# EasyEDA Pro project hx_esp32c5_cam.eprj

# Schematic Schematic1
Board Name: Board1; Create Date: 2025-12-30; Page Name: P1; Project Name: hx_esp32c5_cam; Schematic Name: Schematic1; Update Date: 2026-01-05; Company: EasyEDA.com; Page Size: A4; Version: V1.0
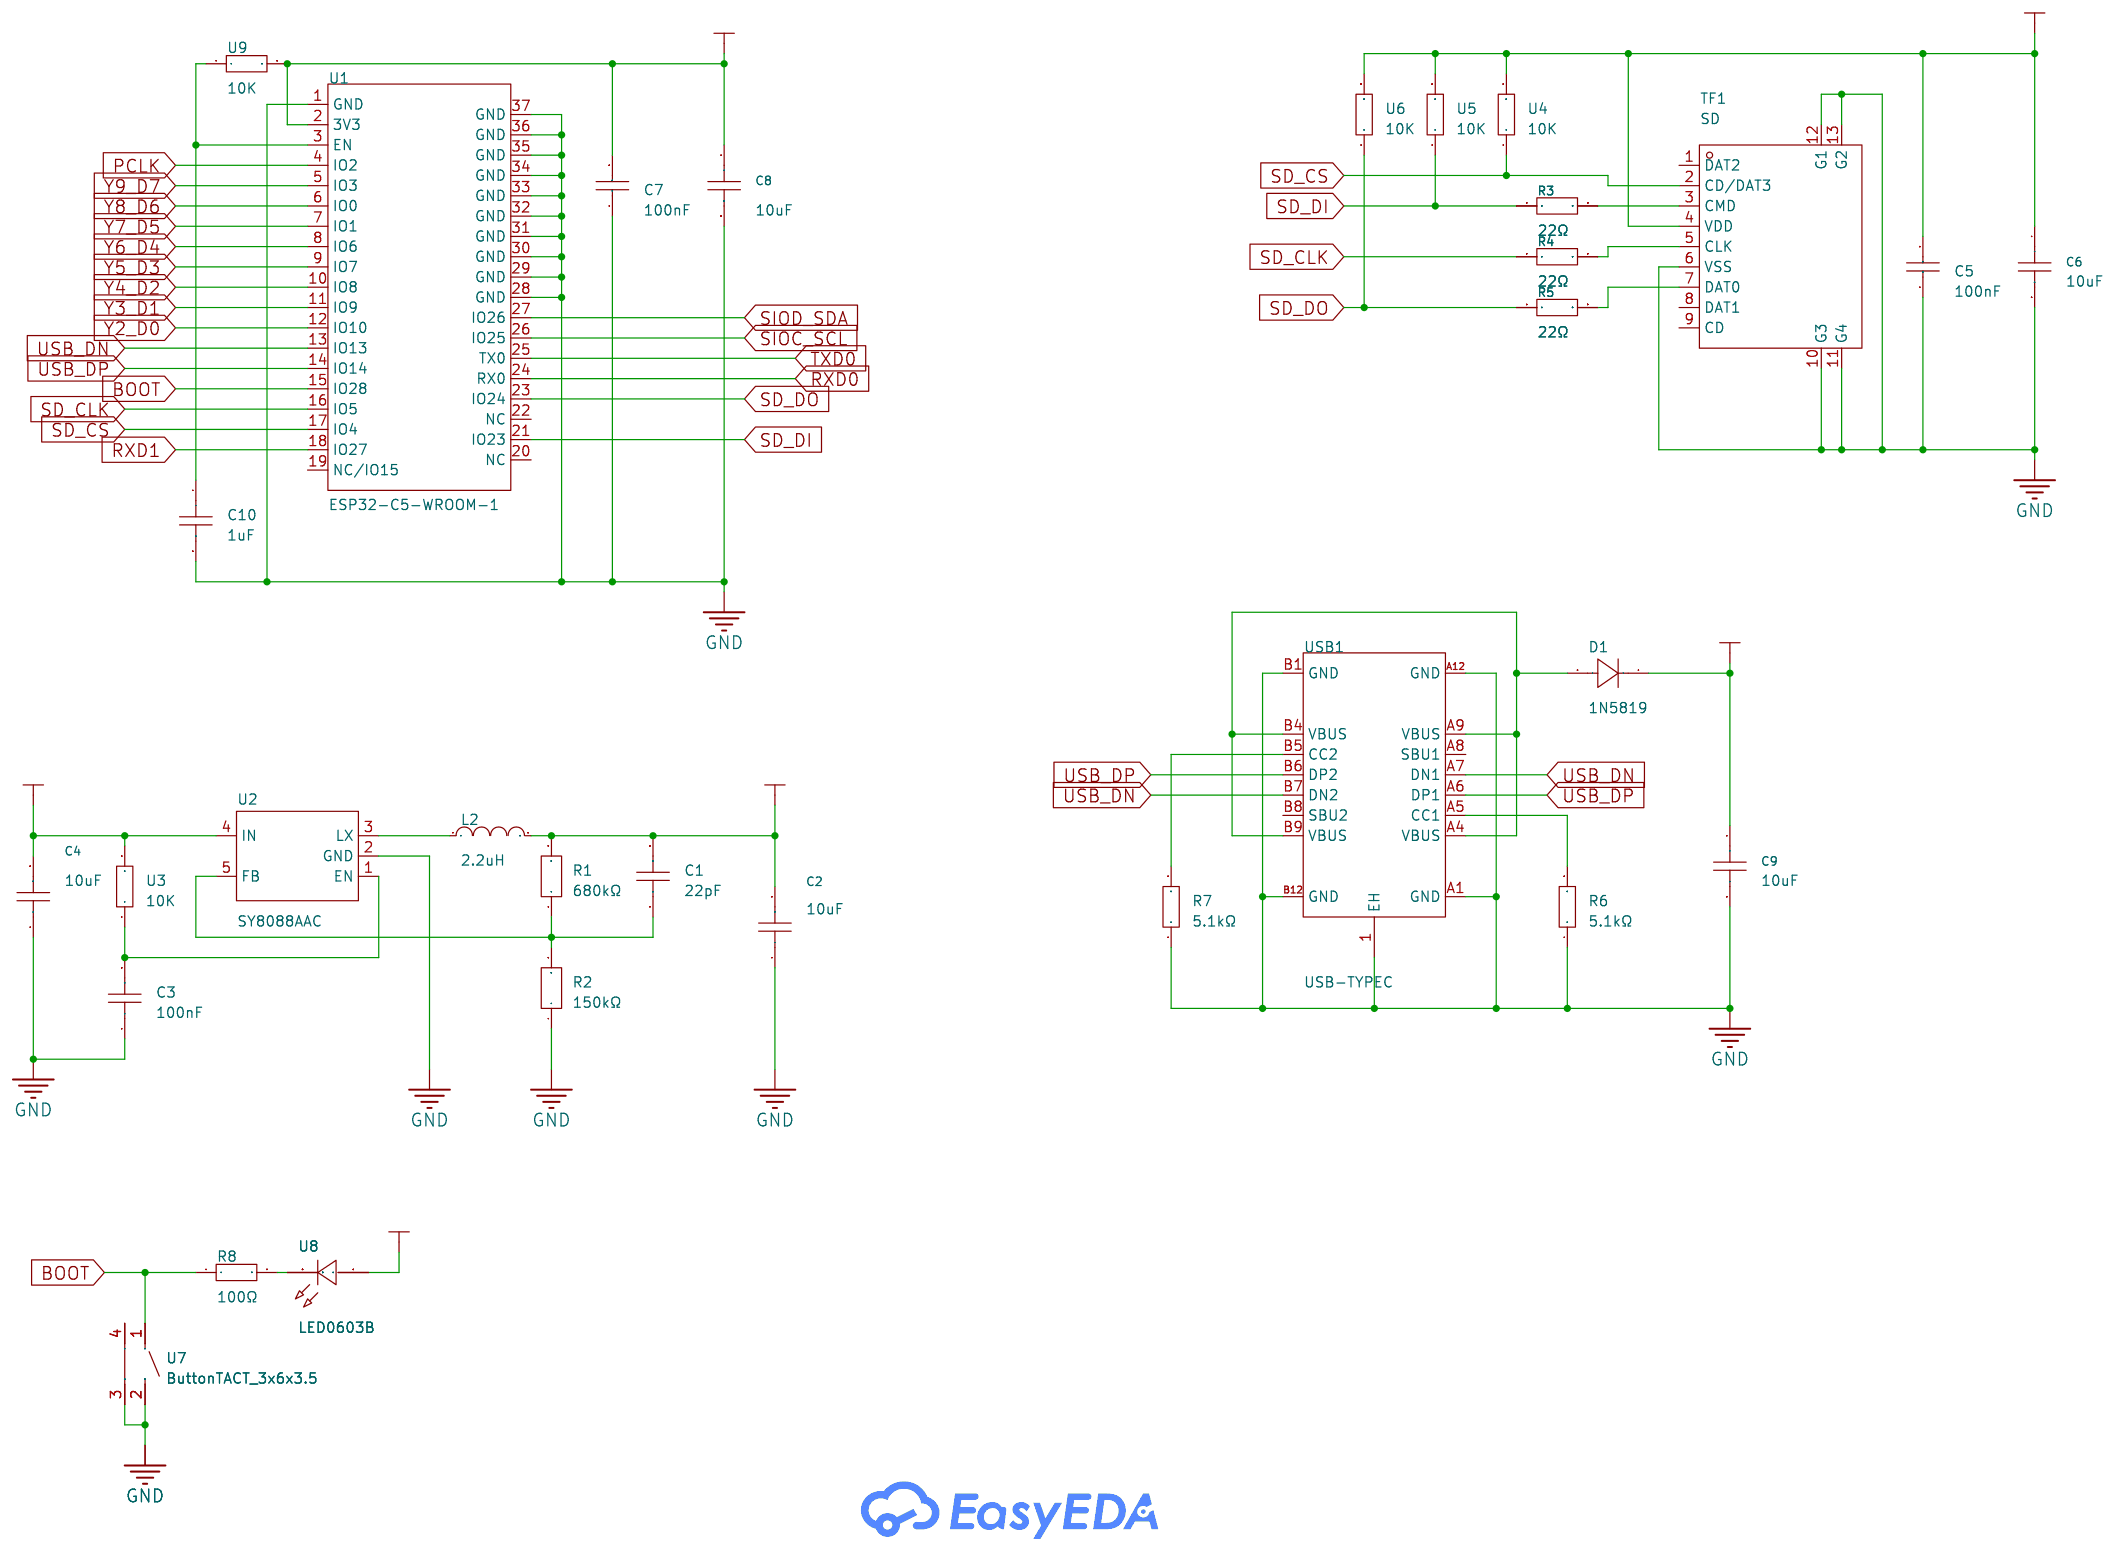
[diagram p0: schematic sheet]

## Parts
C1  22pF  [C0603]
C2  10uF  [C0603]
C3  100nF  [C0805]
C4  10uF  [C0603]
C5  100nF  [C0805]
C6  10uF  [C0603]
C7  100nF  [C0805]
C8  10uF  [C0603]
C9  10uF  [C0603]
C10  1uF  [C0603]
D1  1N5819  [SMA_L4.3-W2.7-LS5.1-RD]
L2  2.2uH  [IND-SMD_L2.0-W1.6_MHP201610]
R1  680kΩ  [R0805]
R2  150kΩ  [R0805]
R3  22Ω  [R0805]
R4  22Ω  [R0805]
R5  22Ω  [R0805]
R6  5.1kΩ  [R0805]
R7  5.1kΩ  [R0805]
R8  100Ω  [R0805]
TF1  SD  [TF-SMD_TF-15-15]
U1  ESP32-C5-WROOM-1  [COMM-SMD_37P-P1.27-L27.5-W18.0-ESP32-C5-WROOM-1]
U2  SY8088AAC  [SOT-23-5_L3.0-W1.7-P0.95-LS2.8-BR]
U3  10K  [R0805]
U4  10K  [R0805]
U5  10K  [R0805]
U6  10K  [R0805]
U7  ButtonTACT_3x6x3.5  [SW-SMD_L7.8-W3.5-P4.00-EH]
U8  LED0603B  [LED0603-R-RD_BLUE]
U9  10K  [R0805]
USB1  USB-TYPEC  [TYPE-C-SMD_16P-EH4]

## Library data of the parts
C1 = CC0603FPNPO9BN220: LCSC Part Name: 22pF ±1% 50V; Supplier Part: C1853871; Manufacturer: YAGEO(国巨); Supplier Footprint: 0603; JLCPCB Part Class: Extended Part; Datasheet: https://atta.szlcsc.com/upload/public/pdf/source/20210519/C1853871_98377D90EE8CBCBFC774064AEE2ACD16.pdf; Supplier: LCSC; Tolerance: ±1%; Voltage Rating: 50V; Temperature Coefficient: NP0
C2 C4 C6 C8 C9 = 10uF_C15415: LCSC Part Name: 10uF ±20% 16V; Supplier Part: C15415; Manufacturer: SAMSUNG(三星); Supplier Footprint: 0603; JLCPCB Part Class: Extended Part; Datasheet: https://atta.szlcsc.com/upload/public/pdf/source/20160218/1457707763339.pdf; Supplier: LCSC; Tolerance: ±20%
C3 = CC0805KRX7R9BB104: LCSC Part Name: 100nF ±10% 50V; Supplier Part: C49678; Manufacturer: YAGEO(国巨); Supplier Footprint: 0805; JLCPCB Part Class: Basic Part; Datasheet: https://item.szlcsc.com/datasheet/CC0805KRX7R9BB104/50686.html; Supplier: LCSC; Tolerance: ±10%; Voltage Rating: 50V; Temperature Coefficient: X7R
C5 C7 = CL21B104KCFNNNE: LCSC Part Name: 100nF ±10% 100V; Supplier Part: C28233; Manufacturer: SAMSUNG(三星); Supplier Footprint: 0805; JLCPCB Part Class: Basic Part; Datasheet: https://item.szlcsc.com/datasheet/CL21B104KCFNNNE/28983.html; Supplier: LCSC; Tolerance: ±10%; Voltage Rating: 100V; Temperature Coefficient: X7R
C10 = CGB3B1X6S1C105K055AC: LCSC Part Name: 1uF ±10% 16V; Supplier Part: C2169245; Manufacturer: TDK; Supplier Footprint: 0603; JLCPCB Part Class: Extended Part; Datasheet: https://atta.szlcsc.com/upload/public/pdf/source/20191105/C343012_3F47E91403558E3EBEE82CA44A798D40.pdf; Supplier: LCSC; Tolerance: ±10%
D1 = 1N5819: Supplier Part: C2892330; Supplier Footprint: SMA_L4.3-W2.7-LS5.1; JLCPCB Part Class: Extended Part; Supplier: LCSC
L2 = HPI201612P-2R2M: LCSC Part Name: 2.2uH ±20%; Supplier Part: C326048; Manufacturer: 3L COILS(三礼); Supplier Footprint: 0806; JLCPCB Part Class: Extended Part; Datasheet: https://atta.szlcsc.com/upload/public/pdf/source/20190129/C326177_DB7B9D3ABD54B912F06BF7766A7A8FBD.pdf; Supplier: LCSC; Tolerance: ±20%; Current Rating: 1.6A; DC Resistance(DCR): 120mΩ
R1 = TC0525B6803T5E: LCSC Part Name: 680kΩ ±0.1% 250mW 薄膜电阻; Supplier Part: C425382; Manufacturer: UNI-ROYAL(厚声); Supplier Footprint: 0805; JLCPCB Part Class: Extended Part; Datasheet: https://atta.szlcsc.com/upload/public/pdf/source/20190904/C425668_F2F639A313B6F33D501F342892FD5229.pdf; Supplier: LCSC; Type: Thin Film Resistor; Tolerance: ±0.1%; Temperature Coefficient: ±25ppm/℃; Operating Temperature Range: -55℃~+155℃
R2 = AS05W2J0154T5E: LCSC Part Name: 150kΩ ±5% 500mW 厚膜电阻 抗浪涌厚膜晶片电阻器; Supplier Part: C966139; Manufacturer: UNI-ROYAL(厚声); Supplier Footprint: 0805; JLCPCB Part Class: Extended Part; Datasheet: https://atta.szlcsc.com/upload/public/pdf/source/20200723/C560412_34ABBCC623B52ADD707B94178459E29E.pdf; Supplier: LCSC; Type: Thick Film Resistors; Tolerance: ±5%; Temperature Coefficient: ±100ppm/℃; Operating Temperature: -55℃~+155℃
R3-R5 = RMC0805225%N: LCSC Part Name: 22Ω ±5% 125mW; Supplier Part: C269553; Manufacturer: Tyohm(幸亚电阻); Supplier Footprint: 0805; JLCPCB Part Class: Extended Part; Datasheet: https://item.szlcsc.com/datasheet/RMC0805225%2525N/258993.html; Supplier: LCSC; Type: Thick Film Resistor; Tolerance: ±5%; Power(Watts): 125mW; Voltage-Supply(Max): 150V; Temperature Coefficient: ±100ppm/℃; Operating Temperature: -55℃~+155℃
R6 R7 = AECR0805F5K10K9: LCSC Part Name: 车规级 厚膜电阻 5.1kΩ ±1% 125mW; Supplier Part: C328405; Manufacturer: RESI(开步睿思); Supplier Footprint: 0805; JLCPCB Part Class: Extended Part; Datasheet: https://item.szlcsc.com/datasheet/AECR0805F5K10K9/308307.html; Supplier: LCSC; Type: Thick Film Resistor; Tolerance: ±1%; Power(Watts): 125mW; Voltage-Supply(Max): 150V; Temperature Coefficient: ±100ppm/℃; Operating Temperature: -55℃~+155℃
R8 = MCR10EZHJ101: LCSC Part Name: 100Ω ±5% 125mW; Supplier Part: C308365; Manufacturer: ROHM(罗姆); Supplier Footprint: 0805; JLCPCB Part Class: Extended Part; Datasheet: https://atta.szlcsc.com/upload/public/pdf/source/20180927/C308562_C105FB47EB7519E2A4C533708F7CD71F.pdf; Supplier: LCSC; Tolerance: ±5%; Temperature Coefficient: ±200ppm/℃
TF1 = SD: Supplier Part: C9900023771; Supplier Footprint: SIM-SMD; JLCPCB Part Class: Extended Part; Supplier: LCSC
U1 = ESP32-C5-WROOM-1: Supplier Part: C9900205328; Supplier: LCSC
U2 = SY8088AAC: LCSC Part Name: 1.5MHz 1A 同步降压DC/DC调节器; Supplier Part: C79313; Manufacturer: silergy(矽力杰); Supplier Footprint: SOT-23-5; JLCPCB Part Class: Extended Part; Datasheet: https://atta.szlcsc.com/upload/public/pdf/source/20170329/1490752163260.pdf; Supplier: LCSC; Function: Step-down type; Voltage - Supply: 2.5V~5.5V; Frequency - Switching: 1.5MHz; Operating Temperature: -40℃~+125℃; Synchronous Rectifier: Yes; Number of Outputs: 1; Topology: Step-down; Quiescent Current: 40uA
U3-U6 U9 = 10K: Supplier Part: C9900011271; JLCPCB Part Class: Extended Part; Supplier: LCSC
U7 = ButtonTACT_3x6x3.5: Supplier Part: C9900004514; Supplier Footprint: SMD; JLCPCB Part Class: Extended Part; Supplier: LCSC
U8 = LED0603B_C9900038277: Supplier Part: C9900038277; Supplier Footprint: LED0603-BLUE; JLCPCB Part Class: Extended Part; Supplier: LCSC
USB1 = USB-TYPEC: Supplier Part: C9900005249; JLCPCB Part Class: Extended Part; Supplier: LCSC

## Nets
GND: C2.1 C3.1 C4.1 C5.1 C6.2 C7.1 C8.2 C9.2 C10.2 R2.1 R6.1 R7.1 TF1.6(VSS) TF1.10(G3) TF1.11(G4) TF1.12(G1) TF1.13(G2) U1.1(GND) U1.28(GND) U1.29(GND) U1.30(GND) U1.31(GND) U1.32(GND) U1.33(GND) U1.34(GND) U1.35(GND) U1.36(GND) U1.37(GND) U2.2(GND) U7.2 U7.3 USB1.1(EH) USB1.A1(GND) USB1.A12(GND) USB1.B1(GND) USB1.B12(GND)
VCC_3.3V: C1.2 C2.2 C5.2 C6.1 C7.2 C8.1 L2.2 R1.2 TF1.4(VDD) U1.2(3V3) U4.2 U5.2 U6.2 U8.1(A) U9.2
VCC_5V: C4.2 C9.1 D1.1(K) U2.4(IN) U3.2
BOOT: R8.1 U1.15(IO28) U7.1
PCLK: U1.4(IO2)
RXD0: U1.24(RX0)
RXD1: U1.18(IO27)
SD_CLK: R4.1 U1.16(IO5)
SD_CS: TF1.2(CD/DAT3) U1.17(IO4) U4.1
SD_DI: R3.1 U1.21(IO23) U5.1
SD_DO: R5.1 U1.23(IO24) U6.1
SIOC_SCL: U1.26(IO25)
SIOD_SDA: U1.27(IO26)
TXD0: U1.25(TX0)
USB_DN: U1.13(IO13) USB1.A7(DN1) USB1.B7(DN2)
USB_DP: U1.14(IO14) USB1.A6(DP1) USB1.B6(DP2)
Y2_D0: U1.12(IO10)
Y3_D1: U1.11(IO9)
Y4_D2: U1.10(IO8)
Y5_D3: U1.9(IO7)
Y6_D4: U1.8(IO6)
Y7_D5: U1.7(IO1)
Y8_D6: U1.6(IO0)
Y9_D7: U1.5(IO3)
Net-(C1-1): C1.1 R1.1 R2.2 U2.5(FB)
Net-(C3-2): C3.2 U2.1(EN) U3.1
Net-(C10-1): C10.1 U1.3(EN) U9.1
Net-(D1-2): D1.2(A) USB1.A4(VBUS) USB1.A9(VBUS) USB1.B4(VBUS) USB1.B9(VBUS)
Net-(L2-1): L2.1 U2.3(LX)
Net-(R3-2): R3.2 TF1.3(CMD)
Net-(R4-2): R4.2 TF1.5(CLK)
Net-(R5-2): R5.2 TF1.7(DAT0)
Net-(R6-2): R6.2 USB1.A5(CC1)
Net-(R7-2): R7.2 USB1.B5(CC2)
Net-(R8-2): R8.2 U8.2(C)

Not connected (* = marked no-connect by the designer): TF1 1(DAT2) 8(DAT1) 9(CD); U1 19(NC/IO15) 20(NC) 22(NC); U7 4; USB1 A8(SBU1) B8(SBU2)

# Board PCB1
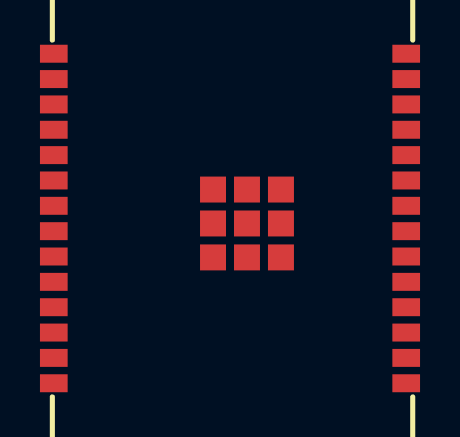
[diagram p1: board, top side]
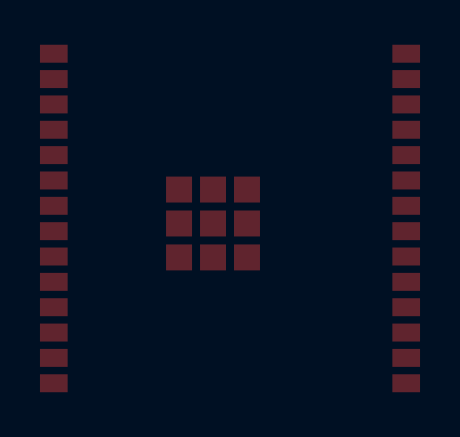
[diagram p2: board, bottom side, seen from below]

No outline. copper layers: Top Layer, Bottom Layer. Coordinates in mm from the lowest, leftmost part position.
Stack: Top Layer 0.035mm / Dielectric1 1.51mm FR4 er 4.5 / Bottom Layer 0.035mm

## Design rules (mm)
template: JLCPCB Capability(Two Layers Board)
spacing copperThickness1oz (default): track to track 0.102, other pairs 0.152 to 0.3
spacing copperThickness2oz: track to track 0.203, other pairs 0.152 to 0.3
track width copperThickness1oz (default): min 0.127, default 0.254, max 2.54
track width copperThickness2oz: min 0.203, default 0.254, max 2.54
differential pair differentialPair (default): width min 0.127, default 0.254, max 2.54; gap min 0.152, default 0.152
via viaSize (default): diameter min 0.5, default 0.61, max 10; hole min 0.3, default 0.305, max 6.3

## Placement (name value [footprint] x y rotation side)
U1  ESP32-C5-WROOM-1  [COMM-SMD_37P-P1.27-L27.5-W18.0-ESP32-C5-WROOM-1]  0 0 0 top

## Footprints (pads in the part's own frame, mm; a bottom-side part is the same pattern mirrored in y, then rotated)
COMM-SMD_37P-P1.27-L27.5-W18.0-ESP32-C5-WROOM-1
  rect 1.385x0.9 smd: 1(-8.818,8.255) 2(-8.818,6.985) 3(-8.818,5.715) 4(-8.818,4.445) 5(-8.818,3.175) 6(-8.818,1.905) 7(-8.818,0.635) 8(-8.818,-0.635) 9(-8.818,-1.905) 10(-8.818,-3.175) 11(-8.818,-4.445) 12(-8.818,-5.715) 13(-8.818,-6.985) 14(-8.818,-8.255) 15(8.818,-8.255) 16(8.818,-6.985) 17(8.818,-5.715) 18(8.818,-4.445) 19(8.818,-3.175) 20(8.818,-1.905) 21(8.818,-0.635) 22(8.818,0.635) 23(8.818,1.905) 24(8.818,3.175) 25(8.818,4.445) 26(8.818,5.715) 27(8.818,6.985) 28(8.818,8.255)
  rect 1.3x1.3 smd: 29(-0.85,1.45) 30(0.85,1.45) 31(2.55,1.45) 32(2.55,-0.25) 33(0.85,-0.25) 34(-0.85,-0.25) 35(-0.85,-1.95) 36(0.85,-1.95) 37(2.55,-1.95)

## Nets
As in the schematic.

Pads without a net: U1 1 2 3 4 5 6 7 8 9 10 11 12 13 14 15 16 17 18 19 20 21 22 23 24 25 26 27 28 29 30 31 32 33 34 35 36 37
